# EAGLE design LightBoard (EAGLE 8.5.0)
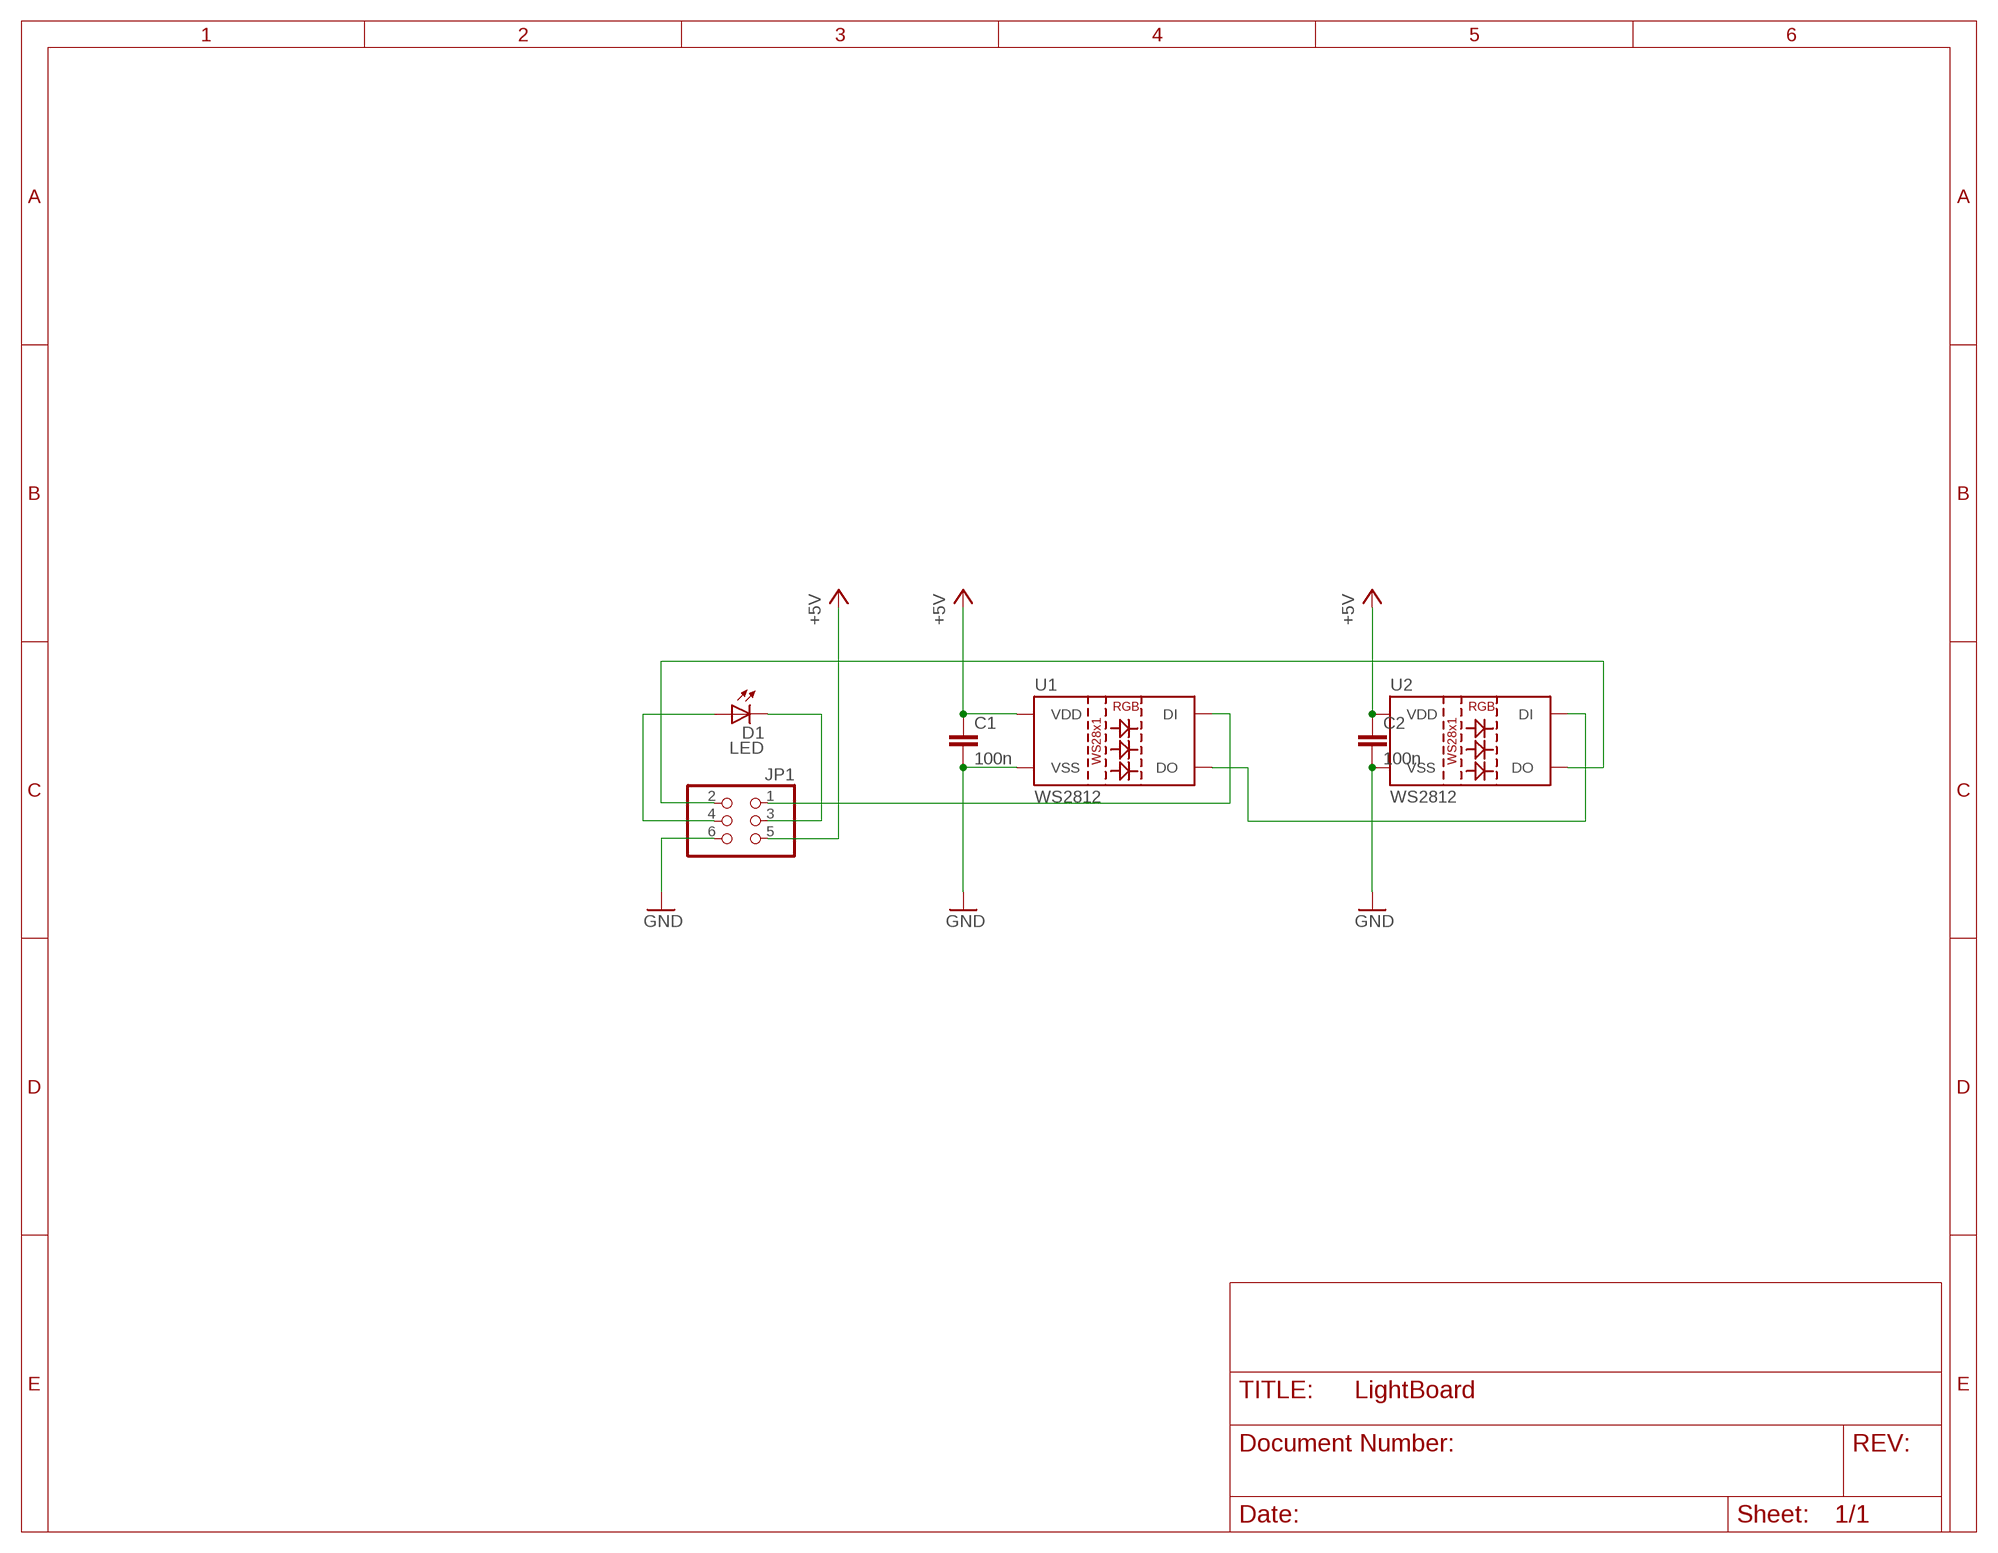
[diagram p0: schematic, sheet 1]

## Parts
C1  100n  C-EUC0603  [C0603]
C2  100n  C-EUC0603  [C0603]
D1  LED  [LM561C]
JP1  PINHD-2X3_2.54-SMD-90°  [2X03SMD/90]
U1  WS2812  WS2812"  [LED-TRICOLOR-5050-IC]
U2  WS2812  WS2812"  [LED-TRICOLOR-5050-IC]

## Nets
+5V: C1.1 C2.1 JP1.5 U1.3(VDD) U1.5(VDD) U2.3(VDD) U2.5(VDD)
GND: C1.2 C2.2 JP1.6 U1.6(VSS) U2.6(VSS)
N$1: U1.1(DO) U2.2(DI)
N$2: JP1.1 U1.2(DI)
N$3: JP1.2 U2.1(DO)
N$5: D1.A1(A) D1.A2(A) D1.A3(A) JP1.4
N$6: D1.C1(C) D1.C2(C) D1.C3(C) JP1.3

## Library data of the parts
C1 C2 = resistor:C-EU: CAPACITOR, European symbol
D1 = PowerComponents:LED
JP1 = pinhead-1:PINHD-2X3: PIN HEADER
U1 U2 = SparkFun-LED:WS2812: WS2812 RGB LED w/ WS2811 driver 5x5mm SMD LED with built-in controller IC. Color: Red/Green/Blue mC Rating: RGB: 550, 1100, 200 mcd Current:RGB: 20, 20, 20 mA Forward Voltage: RGB: 1.8, 3.0, 3.2 V Packages:LED-TRICOLOR-5050-IC SparkFun Products: LED-SMD RGB (WS2812) <https://www.sparkfun.com/products/11821>; PROD_ID: DIO-11598

## Board
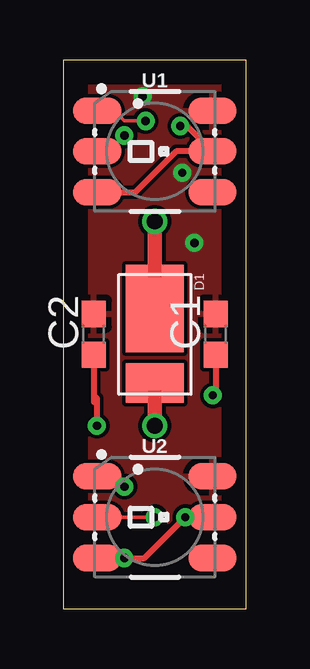
[diagram p1: board, top side]
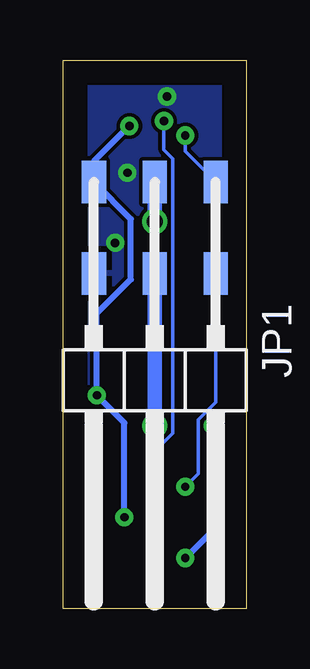
[diagram p2: board, bottom side, seen from below]

Size 7.62 x 22.86 mm. Coordinates in mm from the lower left corner, seen from the top.
Outline: 0,0 7.62,0 7.62,22.86 0,22.85 0,0
Copper layers (1*16): Top 0.035mm / dielectric 1.5mm / Bottom 0.035mm
Design rules "default *": minimum track width 6mil, minimum drill 0.35mm, track to track 6mil, track to pad 6mil, pad to pad 6mil, via to via 6mil, smd to smd 6mil, copper to edge 40mil, drill to drill 6mil, minimum pad ring 10mil, minimum via ring 8mil, stop-mask expansion 4mil, vias tented up to drill 15mil, thermal gap 10mil

### Footprints (pad centres in the part's own frame; a part is rotated, then mirrored left to right if it is on the bottom)
C0603 = smd 1.1 x 1: 1 -0.85,0; 2 0.85,0
LM561C = smd 1.1 x 2.4: A1 1.755,0 | smd 1.65 x 0.9: A2 2.025,0.75; A3 2.025,-0.75 | smd 3.1 x 2.4: C1 -0.8,0 | smd 3.65 x 0.9: C2 -1.075,0.75; C3 -1.075,-0.75
2X03SMD/90 = smd 1.016 x 1.778: 1 -1.27,-8.89; 2 -1.27,-5.08; 3 1.27,-8.89; 4 1.27,-5.08; 5 3.81,-8.89; 6 3.81,-5.08
LED-TRICOLOR-5050-IC = smd 2 x 1.1: 1 -2.4,1.7; 2 -2.4,0; 3 -2.4,-1.7; 4 2.4,-1.7; 5 2.4,0; 6 2.4,1.7

### Placement (x,y rotation side)
C1  6.35,11.43 90 top
C2  1.27,11.43 90 top
D1  3.81,11.43 270 top
JP1  2.54,8.89 180 bottom
U1  3.81,19.05 0 top
U2  3.81,3.81 0 top

### Tracks (layer width: path | path; a pad name or v marks a point on that pad's centre or on a via)
+5V  (via drill 0.35)
  Top 0.254: C2.1 1.27,8.89 | 1.27,8.89 1.27,8.6 | C1.1 6.35,9.01 v6.23,8.89 | U1.3 3,17.35 4.7,19.05 U1.5 5.15,20.11 v4.87,20.11 | U2.3 v2.54,2.11 3.38,2.11 v5.08,3.81 U2.5 | 1.27,8.89 1.39,8.77 v1.39,7.62
  Bottom 0.254: JP1.5 4.8,16.23 4.8,13.72 6.23,12.3 v6.23,8.89 5.08,7.74 v5.08,3.81 | v1.39,7.62 1.39,3.26 v2.54,2.11 | JP1.5 6.21,17.92 | v4.87,20.11 6.35,18.63 JP1.5
GND  (via drill 0.35)
  other vias: 5.46,15.24 4.95,18.16 3.3,21.34
  pour Top: 0,22.86 7.62,22.86 7.62,0 0,0
  pour Bottom: 0,0 8.89,0 8.89,24.13 -1.27,24.13 -1.27,0
N$1  (via drill 0.35)
  Top 0.152: U2.2 v3.81,3.81 | v3.43,20.32 2.54,20.32 2.11,20.75 U1.1
  Bottom 0.152: v3.81,3.81 3.81,6.55 3.05,7.31 3.05,18.74 3.43,19.12 v3.43,20.32
N$2  (via drill 0.35)
  Top 0.152: U1.2 1.88,19.05 v2.54,19.71
  Bottom 0.152: v2.54,19.71 2.54,19.05 JP1.1
N$3  (via drill 0.35)
  Top 0.152: U2.1 2.11,5.51 v2.54,5.08
  Bottom 0.152: JP1.2 1.27,8.6 2,7.87 2,5.62 v2.54,5.08
N$5  (via drill 0.65)
  Top 0.61: D1.A1 v3.81,7.62 | D1.A3 3.54,9.4 D1.A1 | D1.A1 4.29,9.68 D1.A2
  Bottom 0.61: v3.81,7.62 JP1.4
N$6  (via drill 0.65)
  Top 0.61: v3.81,16.13 D1.C1 | D1.C2 4.29,12.23 D1.C1 | D1.C1 3.33,12.23 D1.C3
  Bottom 0.61: JP1.3 v3.81,16.13